# Altium schematic sheet MAIN_SENSOR.SchDoc
size A; SheetNumber: 2; SheetTotal: 7
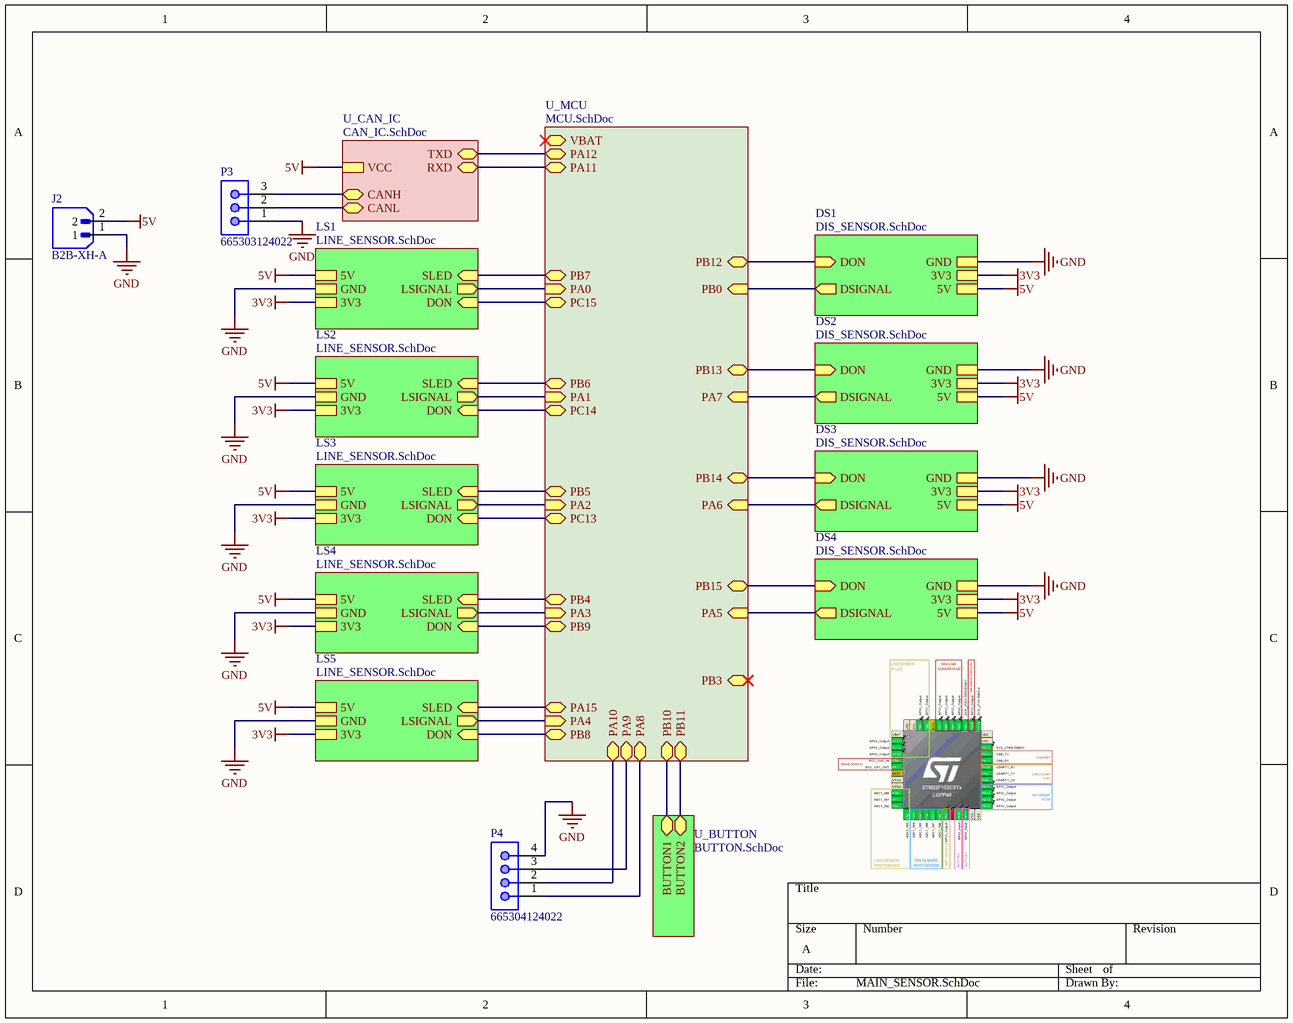
[diagram p0: MAIN_SENSOR.SchDoc]

## Parts
J2  B2B-XH-A  [JST_B2B-XH-A]
P3  665303124022  [665303124022]
P4  665304124022  [665304124022]

## Sub-sheets
DS1 = DIS_SENSOR.SchDoc: DON (in), 5V, GND, 3V3, DSIGNAL (out)
DS2 = DIS_SENSOR.SchDoc: DON (in), 5V, GND, 3V3, DSIGNAL (out)
DS3 = DIS_SENSOR.SchDoc: DON (in), 5V, GND, 3V3, DSIGNAL (out)
DS4 = DIS_SENSOR.SchDoc: DON (in), 5V, GND, 3V3, DSIGNAL (out)
LS1 = LINE_SENSOR.SchDoc: DON (in), 5V, GND, 3V3, LSIGNAL (out), SLED (in)
LS2 = LINE_SENSOR.SchDoc: DON (in), 5V, GND, 3V3, LSIGNAL (out), SLED (in)
LS3 = LINE_SENSOR.SchDoc: DON (in), 5V, GND, 3V3, LSIGNAL (out), SLED (in)
LS4 = LINE_SENSOR.SchDoc: DON (in), 5V, GND, 3V3, LSIGNAL (out), SLED (in)
LS5 = LINE_SENSOR.SchDoc: DON (in), 5V, GND, 3V3, LSIGNAL (out), SLED (in)
U_BUTTON = BUTTON.SchDoc: BUTTON1 (bidir), BUTTON2 (bidir)
U_CAN_IC = CAN_IC.SchDoc: CANH (bidir), CANL (bidir), VCC, TXD (bidir), RXD (bidir)
U_MCU = MCU.SchDoc: VBAT (bidir), PA12 (bidir), PA15 (bidir), PA10 (bidir), PA9 (bidir), PA8 (bidir), PA7 (in), PA6 (in), PA5 (in), PA4 (in), PA3 (in), PA2 (in), PA1 (in), PA0 (in), PB0 (in), PC13 (bidir), PB3 (bidir), PB4 (bidir), PB5 (bidir), PB6 (bidir), PB7 (bidir), PB8 (bidir), PB9 (bidir), PB10 (bidir), PB11 (bidir), PB12 (bidir), PB13 (bidir), PB14 (bidir), PB15 (bidir), PA11 (bidir), PC14 (bidir), PC15 (bidir)

## Nets
3V3: sheet LS1/3V3, sheet DS4/3V3, sheet LS2/3V3, sheet LS3/3V3, sheet LS4/3V3, sheet LS5/3V3, sheet DS1/3V3, sheet DS2/3V3, sheet DS3/3V3
5V: J2.2 ; sheet U_CAN_IC/VCC, sheet LS1/5V, sheet DS4/5V, sheet LS2/5V, sheet LS3/5V, sheet LS4/5V, sheet LS5/5V, sheet DS1/5V, sheet DS2/5V, sheet DS3/5V
GND: J2.1 P3.1 P4.4 ; sheet LS1/GND, sheet DS4/GND, sheet LS2/GND, sheet LS3/GND, sheet LS4/GND, sheet LS5/GND, sheet DS1/GND, sheet DS2/GND, sheet DS3/GND
NetP3_2: P3.2 ; sheet U_CAN_IC/CANL
NetP3_3: P3.3 ; sheet U_CAN_IC/CANH
NetP4_1: P4.1 ; sheet U_MCU/PA8
NetP4_2: P4.2 ; sheet U_MCU/PA10
NetP4_3: P4.3 ; sheet U_MCU/PA9
(unnamed): sheet U_BUTTON/BUTTON1, sheet U_MCU/PB10
(unnamed): sheet U_BUTTON/BUTTON2, sheet U_MCU/PB11
(unnamed): sheet U_MCU/PA12, sheet U_CAN_IC/TXD
(unnamed): sheet U_MCU/PA15, sheet LS5/SLED
(unnamed): sheet U_MCU/PA7, sheet DS2/DSIGNAL
(unnamed): sheet U_MCU/PA6, sheet DS3/DSIGNAL
(unnamed): sheet U_MCU/PA5, sheet DS4/DSIGNAL
(unnamed): sheet U_MCU/PA4, sheet LS5/LSIGNAL
(unnamed): sheet U_MCU/PA3, sheet LS4/LSIGNAL
(unnamed): sheet U_MCU/PA2, sheet LS3/LSIGNAL
(unnamed): sheet U_MCU/PA1, sheet LS2/LSIGNAL
(unnamed): sheet U_MCU/PA0, sheet LS1/LSIGNAL
(unnamed): sheet U_MCU/PB0, sheet DS1/DSIGNAL
(unnamed): sheet U_MCU/PC13, sheet LS3/DON
(unnamed): sheet U_MCU/PB4, sheet LS4/SLED
(unnamed): sheet U_MCU/PB5, sheet LS3/SLED
(unnamed): sheet U_MCU/PB6, sheet LS2/SLED
(unnamed): sheet U_MCU/PB7, sheet LS1/SLED
(unnamed): sheet U_MCU/PB8, sheet LS5/DON
(unnamed): sheet U_MCU/PB9, sheet LS4/DON
(unnamed): sheet U_MCU/PB12, sheet DS1/DON
(unnamed): sheet U_MCU/PB13, sheet DS2/DON
(unnamed): sheet U_MCU/PB14, sheet DS3/DON
(unnamed): sheet U_MCU/PB15, sheet DS4/DON
(unnamed): sheet U_MCU/PA11, sheet U_CAN_IC/RXD
(unnamed): sheet U_MCU/PC14, sheet LS2/DON
(unnamed): sheet U_MCU/PC15, sheet LS1/DON

## Library data of the parts
J2 = B2B-XH-A: MF: {'manufacturer': u'JST Sales America Inc.'}; System: Connector; Package: None; Price: None; Value: *; MP: B2B-XH-A; Availability: Unavailable
P3 = CMP-002-01223-1: WR-WTB SMT Male Vertical Shrouded Header, pitch 1mm, 3p; Contact Resistance: 20mOhm; Rated Current: 1A; Withstanding Voltage: 500VAC; Value: 1A, 125 V (AC); Pin Number: 3; Working Voltage: 50VAC; Supplier 1 URL: https://www.mouser.vn/ProductDetail/Wurth-Elektronik/665303124022?qs=a9WhcLg8qCyV5ri9HU4hCQ%3D%3D; ComponentLink2URL: https://www.we-online.com/catalog/datasheet/665303124022.pdf; Packaging: Tape and Reel; Supplier 2 SN: N/A; Source: WR-WTB_1.00mm.SchLib; Publisher: Wurth Elektronik; Supplier 2 Name: Digi-Key; Supplier 3 SN: N/A; Published Date: January 2020; ComponentLink4Description: Global Supply; Mounting Technology: SMT; ComponentLink1Description: Manufacturer; Supplier 3 URL: N/A; Supplier 2 URL: N/A; Operating Temperature: -25 to +85degC; Type: Vertical; ComponentLink3URL: https://www.we-online.com/en/components/products/WTB_1_00_SMT_MALE_VERTICAL_SHROUDED_HEADER_6653XX124022?sq=665303124022#665303124022; Design Item ID: 665303124022; Component Type: Standard; Pitch: 1mm; ComponentLink2Description: Datasheet; Part Number: 665303124022; Gender: Male; Supplier 1 SN: 710-665303124022; Pins: 3; ComponentLink4URL: https://www.mouser.vn/ProductDetail/Wurth-Elektronik/665303124022?qs=a9WhcLg8qCyV5ri9HU4hCQ%3D%3D; Supplier 1 Name: Mouser; Supplier 3 Name: thegioiic; ComponentLink1URL: http://www.we-online.de; ComponentLink3Description: Global Supply
P4 = CMP-002-01224-1: WR-WTB SMT Male Vertical Shrouded Header, pitch 1mm, 4p; Rated Current: 1A; Value: 1A, 125 V (AC); Contact Resistance: 20mOhm; Working Voltage: 50VAC; Withstanding Voltage: 500VAC; Pin Number: 4; Mounting Technology: SMT; Supplier 3 Name: thegioiic; Supplier 2 URL: N/A; Supplier 3 URL: N/A; Packaging: Tape and Reel; Gender: Male; ComponentLink4URL: https://www.mouser.vn/ProductDetail/Wurth-Elektronik/665304124022?qs=a9WhcLg8qCx8aEna1KcTfg%3D%3D; Source: WR-WTB_1.00mm.SchLib; ComponentLink3Description: Global Supply; Supplier 3 SN: N/A; ComponentLink4Description: Global Supply; ComponentLink2URL: https://www.we-online.com/catalog/datasheet/665304124022.pdf; Component Type: Standard; Type: Vertical; ComponentLink1URL: http://www.we-online.de; Pins: 4; Publisher: Wurth Elektronik; Supplier 1 SN: 710-665304124022; ComponentLink2Description: Datasheet; Supplier 2 Name: Digi-Key; ComponentLink1Description: Manufacturer; Operating Temperature: -25 to +85degC; ComponentLink3URL: https://www.we-online.com/en/components/products/WTB_1_00_SMT_MALE_VERTICAL_SHROUDED_HEADER_6653XX124022?sq=665304124022#665304124022; Published Date: January 2020; Supplier 1 URL: https://www.mouser.vn/ProductDetail/Wurth-Elektronik/665304124022?qs=a9WhcLg8qCx8aEna1KcTfg%3D%3D; Supplier 2 SN: N/A; Supplier 1 Name: Mouser; Design Item ID: 665304124022; Pitch: 1mm; Part Number: 665304124022